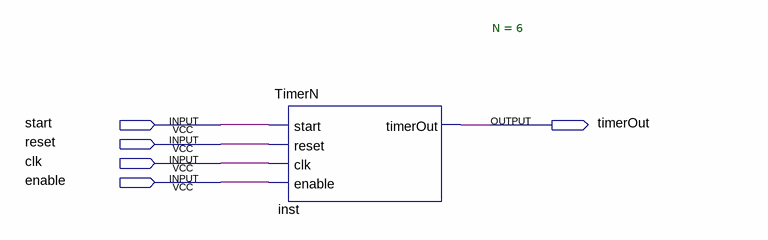
[diagram p0: schematic sheet]
// Quartus schematic TimerN_VHDL.bdf as structural Verilog: 1 symbols, 5 pins
module TimerN_VHDL (
  input  start,
  input  reset,
  input  clk,
  input  enable,
  output timerOut
);

  TimerN #(.N(6)) inst (.start(start), .reset(reset), .clk(clk), .enable(enable), .timerOut(timerOut));
endmodule
